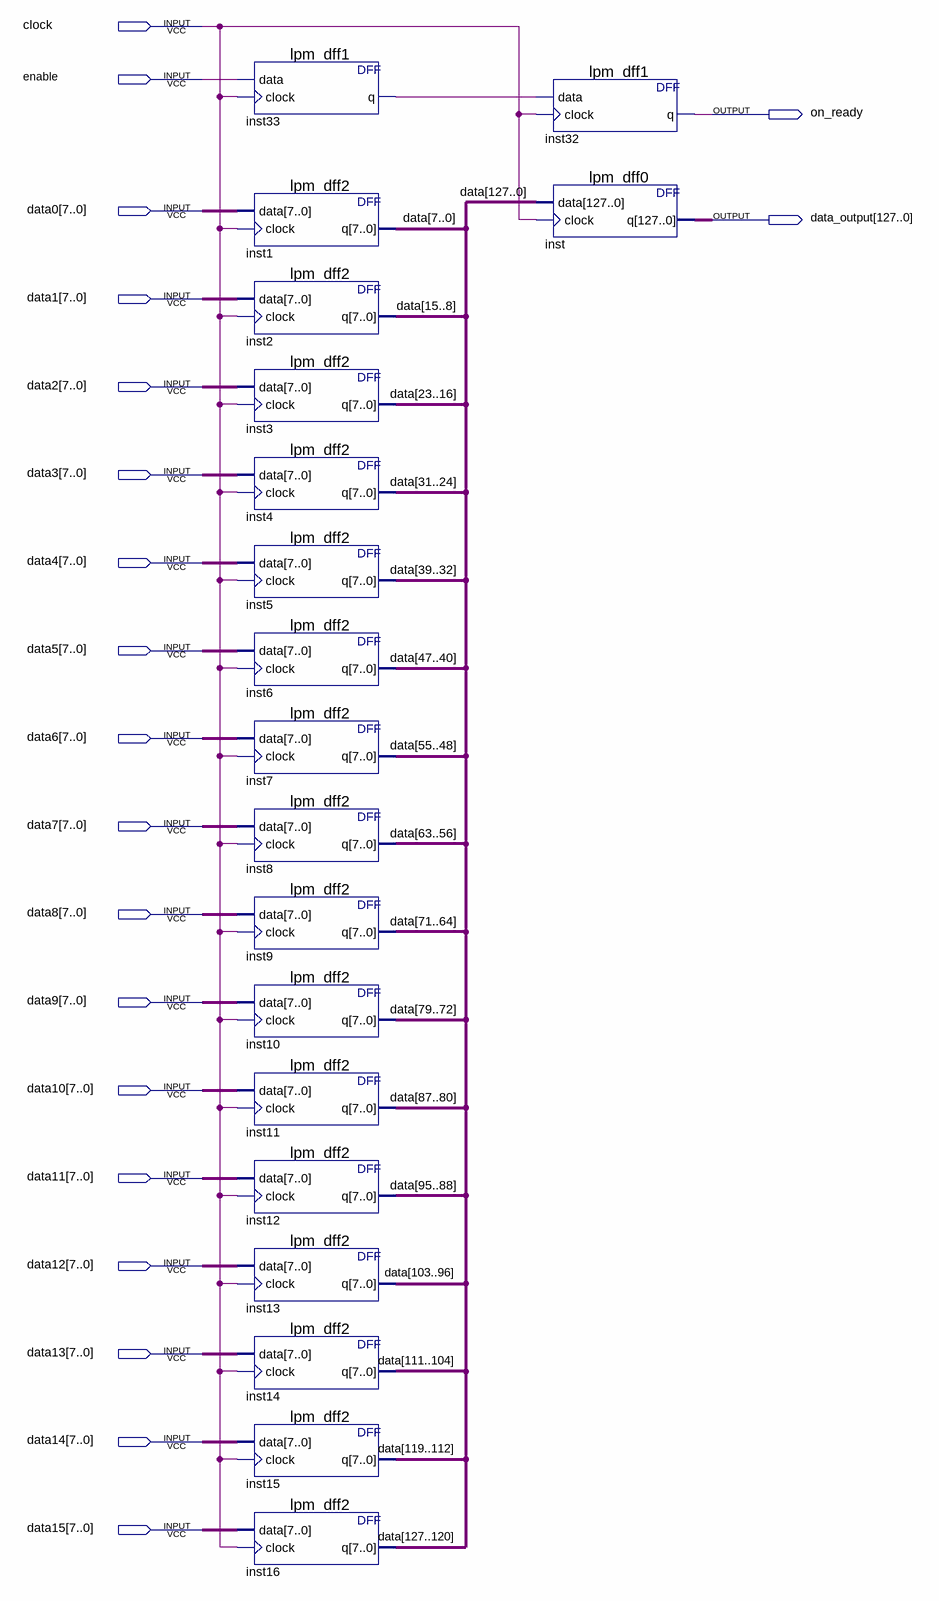
[diagram p0: schematic sheet]
// Quartus schematic 16bytes_to_128bits.bdf as structural Verilog: 19 symbols, 20 pins
module \16bytes_to_128bits  (
  input  clock,
  input  enable,
  input  [7:0] data0,
  input  [7:0] data1,
  input  [7:0] data2,
  input  [7:0] data3,
  input  [7:0] data4,
  input  [7:0] data5,
  input  [7:0] data6,
  input  [7:0] data7,
  input  [7:0] data8,
  input  [7:0] data9,
  input  [7:0] data10,
  input  [7:0] data11,
  input  [7:0] data12,
  input  [7:0] data13,
  input  [7:0] data14,
  input  [7:0] data15,
  output on_ready,
  output [127:0] data_output
);

  wire inst33_q;
  wire [127:0] data;

  lpm_dff1 inst33 (.data(enable), .clock(clock), .q(inst33_q));
  lpm_dff2 inst1 (.data(data0), .clock(clock), .q(data[7:0]));
  lpm_dff2 inst2 (.data(data1), .clock(clock), .q(data[15:8]));
  lpm_dff2 inst3 (.data(data2), .clock(clock), .q(data[23:16]));
  lpm_dff2 inst4 (.data(data3), .clock(clock), .q(data[31:24]));
  lpm_dff2 inst5 (.data(data4), .clock(clock), .q(data[39:32]));
  lpm_dff2 inst6 (.data(data5), .clock(clock), .q(data[47:40]));
  lpm_dff2 inst7 (.data(data6), .clock(clock), .q(data[55:48]));
  lpm_dff2 inst8 (.data(data7), .clock(clock), .q(data[63:56]));
  lpm_dff2 inst9 (.data(data8), .clock(clock), .q(data[71:64]));
  lpm_dff2 inst10 (.data(data9), .clock(clock), .q(data[79:72]));
  lpm_dff2 inst11 (.data(data10), .clock(clock), .q(data[87:80]));
  lpm_dff2 inst12 (.data(data11), .clock(clock), .q(data[95:88]));
  lpm_dff2 inst13 (.data(data12), .clock(clock), .q(data[103:96]));
  lpm_dff2 inst14 (.data(data13), .clock(clock), .q(data[111:104]));
  lpm_dff2 inst15 (.data(data14), .clock(clock), .q(data[119:112]));
  lpm_dff2 inst16 (.data(data15), .clock(clock), .q(data[127:120]));
  lpm_dff1 inst32 (.data(inst33_q), .clock(clock), .q(on_ready));
  lpm_dff0 inst (.data(data), .clock(clock), .q(data_output));
endmodule
